# Altium schematic sheet MCU-MUSIC PLAYER.schdoc
size 231 x 195 mm; SheetNumber: 1; SheetTotal: 1
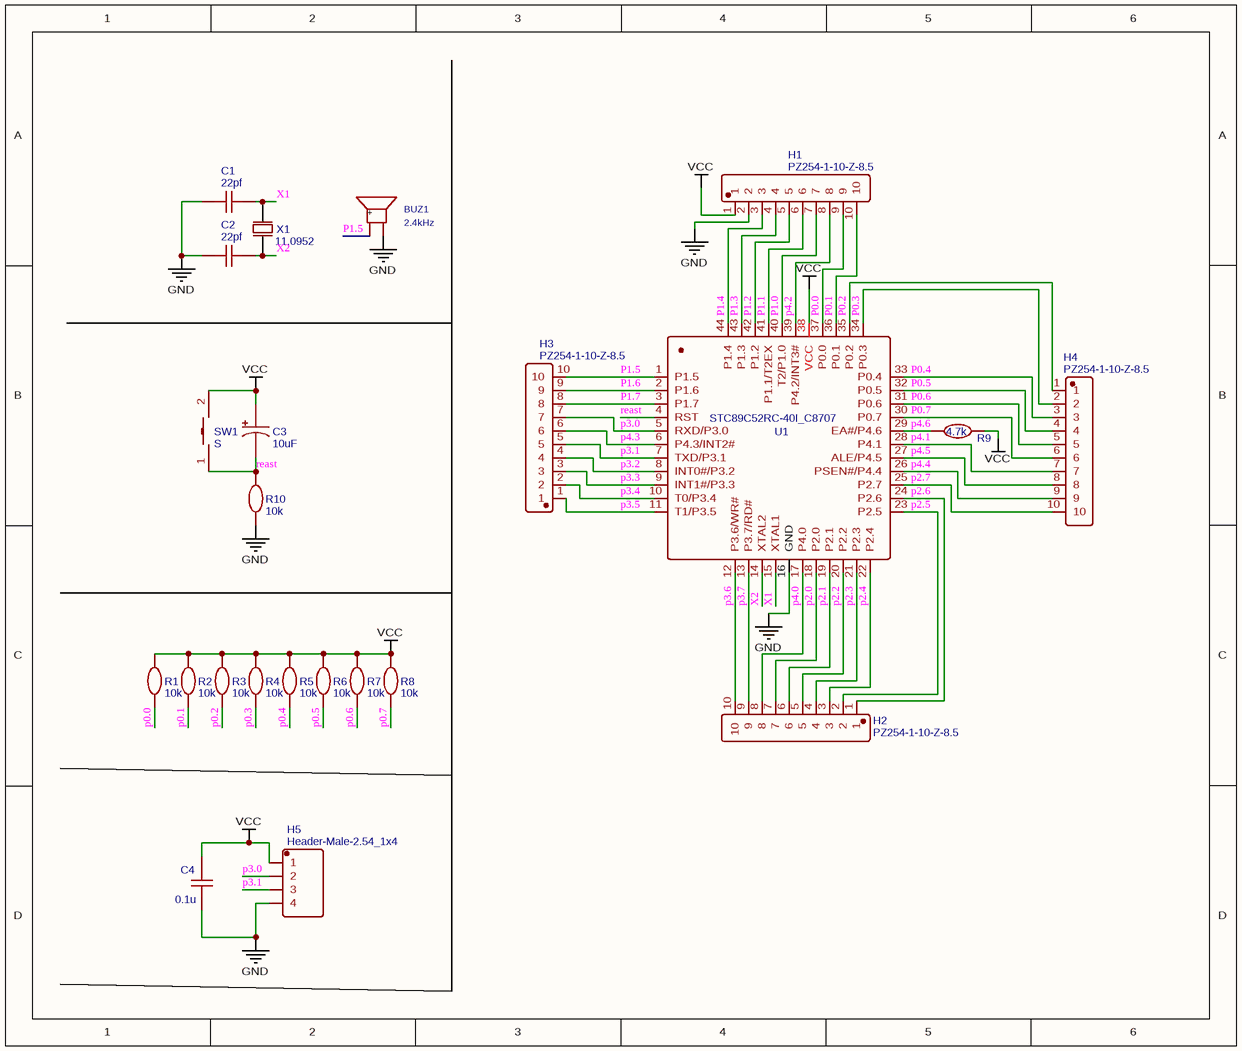
[diagram p0: MCU-MUSIC PLAYER.schdoc]

## Parts
BUZ1  2.4kHz  [BUZ-TH_BD12.0-P7.60-D0.6-FD]
C1  22pf  [C0603]
C2  22pf  [C0603]
C3  10uF  [CAP-SMD_BD4.0-L4.3-W4.3-LS5.0-FD]
C4  0.1u  [C0603]
H1  PZ254-1-10-Z-8.5  [HDR-TH_10P-P2.54-V-M]
H2  PZ254-1-10-Z-8.5  [HDR-TH_10P-P2.54-V-M]
H3  PZ254-1-10-Z-8.5  [HDR-TH_10P-P2.54-V-M]
H4  PZ254-1-10-Z-8.5  [HDR-TH_10P-P2.54-V-M]
H5  Header-Male-2.54_1x4  [HDR-TH_4P-P2.54-V-M]
R1  10k  [R0603]
R2  10k  [R0603]
R3  10k  [R0603]
R4  10k  [R0603]
R5  10k  [R0603]
R6  10k  [R0603]
R7  10k  [R0603]
R8  10k  [R0603]
R9  4.7k  [R0603]
R10  10k  [R0603]
SW1  S  [SW-SMD_L6.0-W3.3-LS8.0]
U1  STC89C52RC-40I_C8707  [LQFP-44_L10.0-W10.0-P0.80-LS12.0-BL]
X1  11.0952  [CRYSTAL-SMD_2P-L5.0-W3.2]

## Nets
GND: BUZ1.2 C1.1 C2.1 C4.1 H1.2 H5.4 R10.1 U1.16(GND)
VCC: C3.1 C4.2 H1.1 H5.1 R1.2 R2.2 R3.2 R4.2 R5.2 R6.2 R7.2 R8.2 R9.2 SW1.2 U1.38(VCC)
P0.0: H1.9 R1.1 U1.37(P0.0)
P0.1: H1.10 R2.1 U1.36(P0.1)
P0.2: H4.1 R3.1 U1.35(P0.2)
P0.3: H4.2 R4.1 U1.34(P0.3)
P0.4: H4.3 R5.1 U1.33(P0.4)
P0.5: H4.4 R6.1 U1.32(P0.5)
P0.6: H4.5 R7.1 U1.31(P0.6)
P0.7: H4.6 R8.1 U1.30(P0.7)
P1.0: H1.7 U1.40(T2/P1.0)
P1.1: H1.6 U1.41(P1.1/T2EX)
P1.2: H1.5 U1.42(P1.2)
P1.3: H1.4 U1.43(P1.3)
P1.4: H1.3 U1.44(P1.4)
P1.5: BUZ1.1(+) H3.10 U1.1(P1.5)
P1.6: H3.9 U1.2(P1.6)
P1.7: H3.8 U1.3(P1.7)
p2.0: H2.7 U1.18(P2.0)
p2.1: H2.6 U1.19(P2.1)
p2.2: H2.5 U1.20(P2.2)
p2.3: H2.4 U1.21(P2.3)
p2.4: H2.3 U1.22(P2.4)
p2.5: H2.2 U1.23(P2.5)
p2.6: H2.1 U1.24(P2.6)
p2.7: H4.10 U1.25(P2.7)
p3.0: H3.7 H5.2 U1.5(RXD/P3.0)
p3.1: H3.5 H5.3 U1.7(TXD/P3.1)
p3.2: H3.4 U1.8(INT0#/P3.2)
p3.3: H3.3 U1.9(INT1#/P3.3)
p3.4: H3.2 U1.10(T0/P3.4)
p3.5: H3.1 U1.11(T1/P3.5)
p3.6: H2.10 U1.12(P3.6/WR#)
p3.7: H2.9 U1.13(P3.7/RD#)
p4.0: H2.8 U1.17(P4.0)
p4.1: H4.7 U1.28(P4.1)
p4.2: H1.8 U1.39(P4.2/INT3#)
p4.3: H3.6 U1.6(P4.3/INT2#)
p4.4: H4.9 U1.26(PSEN#/P4.4)
p4.5: H4.8 U1.27(ALE/P4.5)
p4.6: R9.1 U1.29(EA#/P4.6)
reast: C3.2 R10.2 SW1.1 U1.4(RST)
X1: C1.2 U1.15(XTAL1) X1.1(OSC1)
X2: C2.2 U1.14(XTAL2) X1.2(OSC2)

## Library data of the parts
BUZ1 = TMB12A05_C96093: 驱动方式:有源(内含驱动线路);构造类型:电磁式;额定电压:-;频率:2.4kHz;声压(SPL):85dB;; Manufacturer: 华能; AddInBom: yes; ModelId: 16ab50e14c5b4f2c986c135bdba60e37; ModelName: BUZ-TH_D12.0-H9.5-P7.60; ModelTransform: 472.44,472.176,0,90,0,0,-0.787,0,-177.165; Voltage - Supply: 4V~8V; Sound Pressure Level(SPL): 85dB; Symbol: TMB12A05; Device: TMB12A05_C96093; LCSC Part Name: TMB12A05; SupplierPart: C96093; ManufacturerPart: TMB12A05; Supplier Footprint: 插件,D=12mm; JLCPCB Part Class: 扩展库; Datasheet: https://atta.szlcsc.com/upload/public/pdf/source/20241025/8A17FE04D767D19A35A06DEF9A82AB1E.pdf; Supplier: LCSC; ConvertToPcb: yes; FootprintName: BUZ-TH_BD12.0-P7.60-D0.6-FD; Driver Circuitry: 有源(内含驱动线路); Technology: 电磁式; Voltage Rating: -; Value: 2.4kHz; Current Consumption: -; Diameter(φD): 12mm; Length: -; Width: -; Height: 9.8mm; Operating Temperature: -
C1 C2 = 22pf: nameAlias: Value(F); Contributor: LCEDA_Lib; spicePre: C; spiceSymbolName: C_0603_US
C3 = 10uF: Manufacturer: HONOR; Manufacturer Part: RVT1V100M0405; nameAlias: Capacitance; Supplier: LCSC; Supplier Part: C86602; JLCPCB Part Class: Extended Part; spicePre: C; spiceSymbolName: RVT1V100M0405
C4 = 0.1u: nameAlias: Value(F); Contributor: LCEDA_Lib; spicePre: C; spiceSymbolName: C_0603_US
H1-H4 = PZ254-1-10-Z-8.5: Manufacturer: HCTL(华灿天禄); Contributor: LCSC; Supplier: LCSC; Supplier Part: C2894933; Manufacturer Part: PZ254-1-10-Z-8.5; spicePre: H; spiceSymbolName: PZ254-1-10-Z-8.5
H5 = Header-Male-2.54_1x4: Manufacturer: Ckmtw; Manufacturer Part: 210S-1*4P L=11.6MMGold-plated black; Contributor: LCSC; Supplier: LCSC; Supplier Part: C124378; JLCPCB Part Class: Extended Part; spicePre: H; spiceSymbolName: Header-Male-2.54_1x4
R1-R8 R10 = 10k: nameAlias: Value(Ω); Contributor: LCEDA_Lib; spicePre: R; spiceSymbolName: R_0603_EU
R9 = 4.7k: nameAlias: Value(Ω); Contributor: LCEDA_Lib; spicePre: R; spiceSymbolName: R_0603_EU
SW1 = S: Manufacturer: XKB Connectivity(中国星坤); Manufacturer Part: TS-1101-C-W; Contributor: LCSC; Supplier: LCSC; Supplier Part: C318938; JLCPCB Part Class: Extended Part; spicePre: S; spiceSymbolName: TS-1101-C-W
U1 = STC89C52RC-40I_C8707: Manufacturer: STC; Supplier: LCSC; Manufacturer Part: STC89C52RC-40I; Supplier Part: C8707; JLCPCB Part Class: Extended Part; spicePre: U; spiceSymbolName: STC89C52RC-40I_C8707
X1 = 11.0952: Manufacturer: Zhejiang Abel Elec; Manufacturer Part: SMD-5032_2P 27.12M 15pF; nameAlias: Frequency; Contributor: LCSC; Supplier: LCSC; Supplier Part: C362484; JLCPCB Part Class: Extended Part; spicePre: X; spiceSymbolName: SMD-5032_2P 27.12M 15pF